# EAGLE design Senslope Alpha 5.0 (EAGLE 9.5.2)
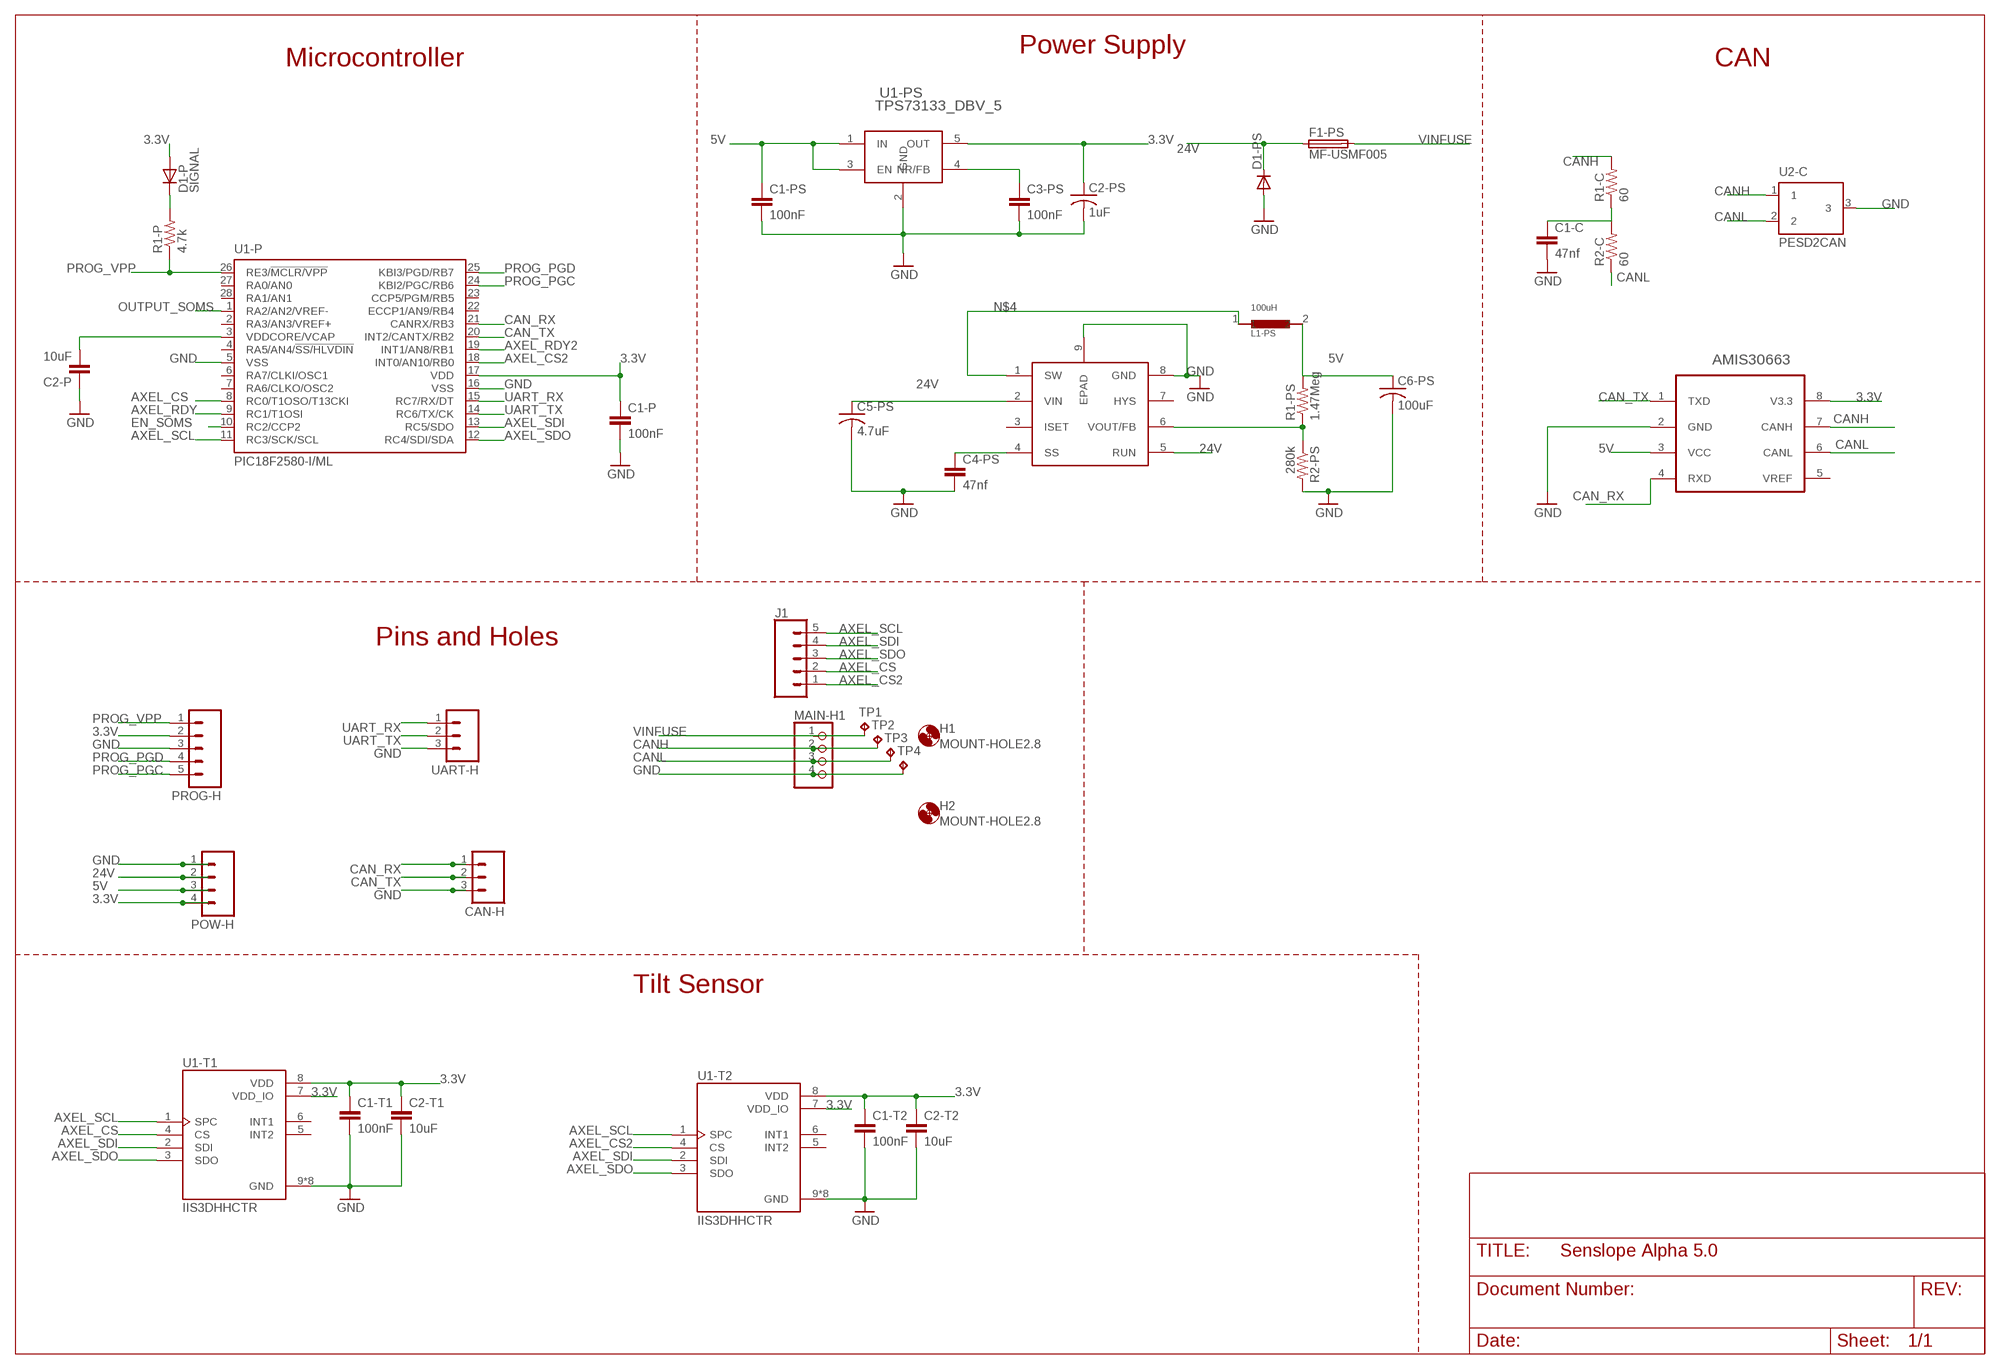
[diagram p0: schematic, sheet 1]

## Parts
C1-C  47nf  C-EUC0805  [C0805]
C1-P  100nF  C-EUC0603  [C0603]
C1-PS  100nF  C-EUC0603  [C0603]
C1-T1  100nF  C-EUC0603  [C0603]
C1-T2  100nF  C-EUC0603  [C0603]
C2-P  10uF  C-EUC0603  [C0603]
C2-PS  1uF  C-USC0402  [C0402]
C2-T1  10uF  C-EUC0603  [C0603]
C2-T2  10uF  C-EUC0603  [C0603]
C3-PS  100nF  C-EUC0603  [C0603]
C4-PS  47nf  C-EUC0805  [C0805]
C5-PS  4.7uF  C-USC1206K  [C1206K]
C6-PS  100uF  C-USC1210K  [C1210K]
CAN-H  UART  M031X03_NO_SILK  [1X03_NO_SILK]
D1-P  SIGNAL  DIODE0603  [DIODE-0603]
D1-PS  DIODE-DO-214AC  [DO-214AC]
F1-PS  MF-USMF005  MF-USMF075  [1210]
H1  MOUNT-HOLE2.8  [2,8]
H2  MOUNT-HOLE2.8  [2,8]
J1  CONN_05NO_SILK  [1X05_NO_SILK]
L1-PS  100uH  LQH32PN101MN0L  [1210]
MAIN-H1  PINHD-1X04_2.54  [1X04]
POW-H  M041X04_NO_SILK  [1X04_NO_SILK]
PROG-H  M05PTH  [1X05@1]
R1-C  60  R-US_R0805  [R0805]
R1-P  4.7k  R-US_R0603  [R0603]
R1-PS  1.47Meg  R-US_R0805  [R0805]
R2-C  60  R-US_R0805  [R0805]
R2-PS  280k  R-US_R0805  [R0805]
TP1  TPTP10SQ  [TP10SQ]
TP2  TPTP10SQ  [TP10SQ]
TP3  TPTP10SQ  [TP10SQ]
TP4  TPTP10SQ  [TP10SQ]
U1-P  PIC18F2580-I/ML  [QFN28-ML_6X6MM]
U1-PS  TPS73133_DBV_5  [DBV5]
U1-T1  IIS3DHHCTR  [IC_IIS3DHHCTR]
U1-T2  IIS3DHHCTR  [IC_IIS3DHHCTR]
U2  AMIS30663CAN  [SOIC8]
U2-C  PESD2CAN  [SOT23]
U2-PS  LTC3631-5  LTC3631  [MSOP8E]
UART-H  UART  M031X03_NO_SILK  [1X03_NO_SILK]

## Nets
3.3V: C1-P.1 C1-T1.1 C1-T2.1 C2-PS.1 C2-T1.1 C2-T2.1 D1-P.A POW-H.4 PROG-H.2 U1-P.17(VDD) U1-PS.5(OUT) U1-T1.7(VDD_IO) U1-T1.8(VDD) U1-T2.7(VDD_IO) U1-T2.8(VDD) U2.8(V3.3)
5V: C1-PS.1 C6-PS.1 L1-PS.2 POW-H.3 R1-PS.2 U1-PS.1(IN) U1-PS.3(EN) U2.3(VCC)
24V: C5-PS.1 D1-PS.1(C) F1-PS.1 POW-H.2 U2-PS.2(VIN) U2-PS.5(RUN)
AXEL_CS: J1.2 U1-P.8(RC0/T1OSO/T13CKI) U1-T1.4(CS)
AXEL_CS2: J1.1 U1-P.18(INT0/AN10/RB0) U1-T2.4(CS)
AXEL_RDY: U1-P.9(RC1/T1OSI)
AXEL_RDY2: U1-P.19(INT1/AN8/RB1)
AXEL_SCL: J1.5 U1-P.11(RC3/SCK/SCL) U1-T1.1(SPC) U1-T2.1(SPC)
AXEL_SDI: J1.4 U1-P.13(RC5/SDO) U1-T1.2(SDI) U1-T2.2(SDI)
AXEL_SDO: J1.3 U1-P.12(RC4/SDI/SDA) U1-T1.3(SDO) U1-T2.3(SDO)
CAN_RX: CAN-H.1 U1-P.21(CANRX/RB3) U2.4(RXD)
CAN_TX: CAN-H.2 U1-P.20(INT2/CANTX/RB2) U2.1(TXD)
CANH: MAIN-H1.2 R1-C.2 TP2.TP U2-C.1 U2.7(CANH)
CANL: MAIN-H1.3 R2-C.1 TP3.TP U2-C.2 U2.6(CANL)
EN_SOMS: U1-P.10(RC2/CCP2)
GND: C1-C.2 C1-P.2 C1-PS.2 C1-T1.2 C1-T2.2 C2-P.1 C2-PS.2 C2-T1.2 C2-T2.2 C3-PS.2 C4-PS.2 C5-PS.2 C6-PS.2 CAN-H.3 D1-PS.2(A) MAIN-H1.4 POW-H.1 PROG-H.3 R2-PS.2 TP4.TP U1-P.5(VSS) U1-P.16(VSS) U1-PS.2(GND) U1-T1.9(GND) U1-T1.10(GND) U1-T1.11(GND) U1-T1.12(GND) U1-T1.13(GND) U1-T1.14(GND) U1-T1.15(GND) U1-T1.16(GND) U1-T2.9(GND) U1-T2.10(GND) U1-T2.11(GND) U1-T2.12(GND) U1-T2.13(GND) U1-T2.14(GND) U1-T2.15(GND) U1-T2.16(GND) U2-C.3 U2-PS.8(GND) U2-PS.9(EPAD) U2.2(GND) UART-H.3
N$3: C1-C.1 R1-C.1 R2-C.2
N$4: L1-PS.1 U2-PS.1(SW)
N$5: C3-PS.1 U1-PS.4(NR/FB)
N$6: R1-PS.1 R2-PS.1 U2-PS.6(VOUT/FB)
N$7: D1-P.C R1-P.2
N$8: C4-PS.1 U2-PS.4(SS)
N$19: C2-P.2 U1-P.3(VDDCORE/VCAP)
OUTPUT_SOMS: U1-P.1(RA2/AN2/VREF-)
PROG_PGC: PROG-H.5 U1-P.24(KBI2/PGC/RB6)
PROG_PGD: PROG-H.4 U1-P.25(KBI3/PGD/RB7)
PROG_VPP: PROG-H.1 R1-P.1 U1-P.26(RE3/!MCLR/VPP)
UART_RX: U1-P.15(RC7/RX/DT) UART-H.1
UART_TX: U1-P.14(RC6/TX/CK) UART-H.2
VINFUSE: F1-PS.2 MAIN-H1.1 TP1.TP
Unconnected: U1-P.2(RA3/AN3/VREF+) U1-P.4(RA5/AN4/!SS/HLVDIN) U1-P.6(RA7/CLKI/OSC1) U1-P.7(RA6/CLKO/OSC2) U1-P.22(ECCP1/AN9/RB4) U1-P.23(CCP5/PGM/RB5) U1-P.27(RA0/AN0) U1-P.28(RA1/AN1) U1-T1.5(INT2) U1-T1.6(INT1) U1-T2.5(INT2) U1-T2.6(INT1) U2-PS.3(ISET) U2-PS.7(HYS) U2.5(VREF)

## Notes on the sheet
- Power Supply
- Microcontroller | CAN
- Pins and Holes
- Tilt Sensor

## Library data of the parts
C1-C C1-PS C1-T1 C1-T2 C2-P C2-T1 C2-T2 C3-PS C4-PS = rcl:C-EU: CAPACITOR, European symbol
C1-P = resistor:C-EU: CAPACITOR, European symbol
C2-PS C5-PS C6-PS = rcl:C-US: CAPACITOR, American symbol
CAN-H UART-H = SparkFun-Connectors:M03: Header 3 Standard 3-pin 0.1" header. Use with straight break away headers (SKU : PRT-00116), right angle break away headers (PRT-00553), swiss pins (PRT-00743), machine pins (PRT-00117), and female headers (PRT-00115). Molex polarized connector foot print use with SKU : PRT-08232 with associated crimp pins and housings.
D1-P = signal_diode:DIODE: Signal diode
D1-PS = dp_devices:DIODE: Various Diode Packages
F1-PS = DRMScustomlib:MF-USMF075
H1 H2 = holes:MOUNT-HOLE: MOUNTING HOLE with drill center marker
J1 = SparkFun-Connectors:CONN_05: Multi connection point. Often used as Generic Header-pin footprint for 0.1 inch spaced/style header connections On any of the 0.1 inch spaced packages, you can populate with these: Break Away Headers - Straight <https://www.sparkfun.com/products/116> (PRT-00116) Break Away Male Headers - Right Angle <https://www.sparkfun.com/products/553> (PRT-00553) Female Headers <https://www.sparkfun.com/products/115> (PRT-00115) Break Away Headers - Machine Pin <https://www.sparkfun.com/products/117> (PRT-00117) Break Away Female Headers - Swiss Machine Pin <https://www.sparkfun.com/products/743> (PRT-00743) For SCREWTERMINALS and SPRING TERMINALS visit here: Screw Terimnals on SparkFun.com <https://www.sparkfun.com/search/results?term=Screw+Terminals> (5mm/3.5mm/2.54mm spacing) This device is also useful as a general connection point to wire up your design to another part of your project. Our various solder wires solder well into these plated through hole pads. Hook-Up Wire - Assortment (Stranded, 22 AWG) <https://www.sparkfun.com/products/11375> (PRT-11375) Hook-Up Wire - Assortment (Solid Core, 22 AWG) <https://www.sparkfun.com/products/11367> (PRT-11367) View the entire wire category on our website here <https://www.sparkfun.com/categories/141> Special notes: Molex polarized connector foot print use with SKU : PRT-08231 with associated crimp pins and housings. 1MM SMD Version SKU: PRT-10208
L1-PS = 1210_inductor:LQH32PN101MN0L
MAIN-H1 = pinhead-2:PINHD-1X04: PIN HEADER
POW-H = SparkFun-Connectors:M04: Header 4 Standard 4-pin 0.1" header. Use with straight break away headers (SKU : PRT-00116), right angle break away headers (PRT-00553), swiss pins (PRT-00743), machine pins (PRT-00117), and female headers (PRT-00115). Molex polarized connector foot print use with SKU : PRT-08231 with associated crimp pins and housings. 1MM SMD Version SKU: PRT-10208
PROG-H = SparkFun-Connectors:M05: Header 5 Standard 5-pin 0.1" header. Use with straight break away headers (SKU : PRT-00116), right angle break away headers (PRT-00553), swiss pins (PRT-00743), machine pins (PRT-00117), and female headers (PRT-00115). Molex polarized connector foot print use with SKU : PRT-08230 with associated crimp pins and housings.
R1-C R1-PS R2-C R2-PS = rcl:R-US_: RESISTOR, American symbol
R1-P = resistor:R-US_: RESISTOR, American symbol
TP1-TP4 = testpad:TP: Test pad
U1-P = PIC18f25k80:PIC18F2*80: 28-Pin Enhanced Flash Microcontrollers with ECAN(TM) Technology 10-Bit A/D and nanoWatt Technology Source: http://www.microchip.com .. 39637a.pdf; MF: MICROCHIP; MPN: PIC18F2580-I/ML; OC_FARNELL: 1556180; OC_NEWARK: 71J7242
U1-PS = DRMScustomlib:TPS73133_DBV_5; DATASHEETURL: http://www.ti.com/lit/gpn/TPS73133; DESCRIPTION: Single Output LDO, 150mA, Fixed(3.3V), Cap free, Low Noise, Fast Transient Response; FAMILY_NAME: SINGLE CHANNEL LDO; GENERIC_PART_NUMBER: TPS73133; INDUSTRY_STD_PKG_TYPE: SOT-23; MANUFACTURER: Texas Instruments; MANUFACTURER_PART_NUMBER: tps73133_dbv_5; PACKAGE_DESIGNATOR: DBV; PIN_COUNT: 5; VENDOR: Texas Instruments
U1-T1 U1-T2 = IIS3DHHCTR:IIS3DHHCTR: High Resolution, High Stability 3-Axes Digital Accelerometer For Industrial Applications; AVAILABILITY: Unavailable; DESCRIPTION: High Resolution, High Stability 3-Axes Digital Accelerometer For Industrial Applications; MF: STMicroelectronics; MP: IIS3DHHCTR; PACKAGE: LGA-16 STMicroelectronics; PRICE: None
U2 = khr_lib4:AMIS30663CAN: https://www.onsemi.com/pub/Collateral/AMIS-30663-D.PDF; MPN: AMIS30663; OC_FARNELL: -; OC_NEWARK: 75C7726; PACKAGE: SOIC-8; SUPPLIER: On Semiconductor
U2-C = PESD2CAN:PESD2CAN
U2-PS = DRMScustomlib:LTC3631

## Board
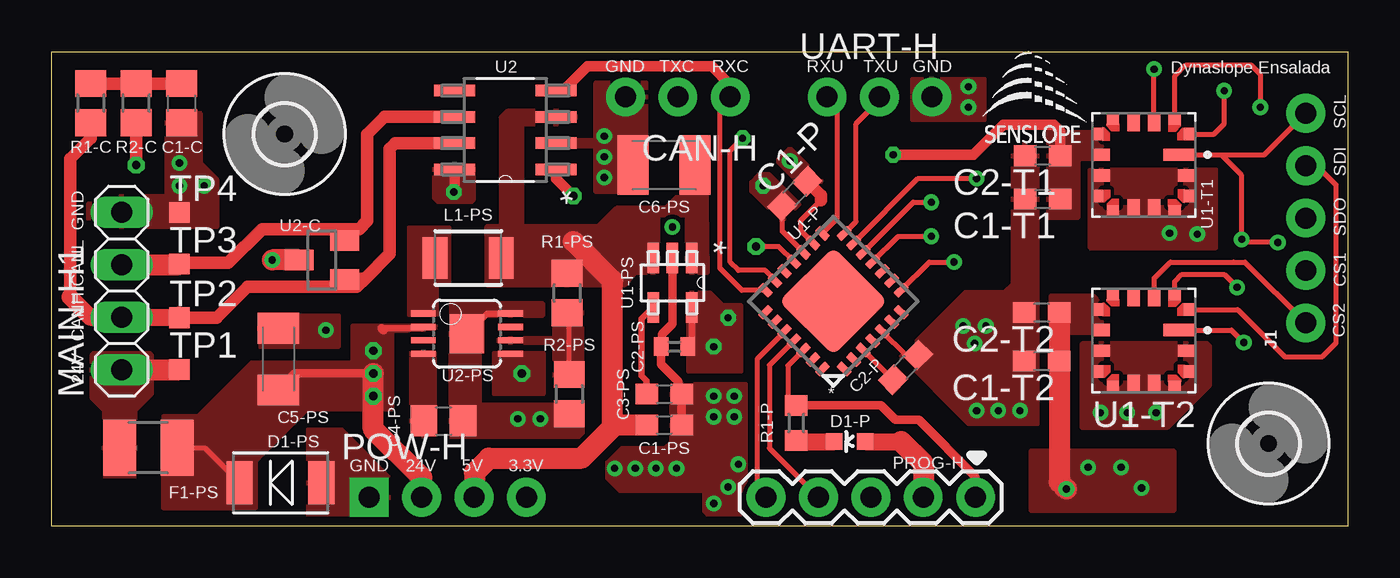
[diagram p1: board, top side]
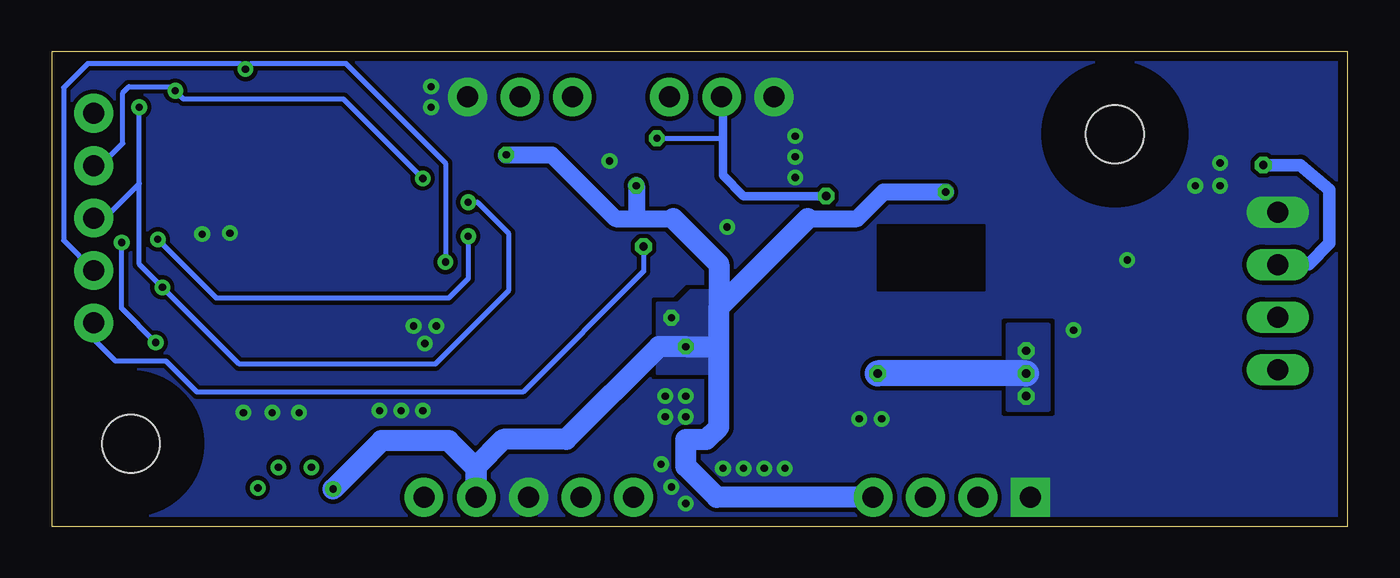
[diagram p2: board, bottom side, seen from below]

Size 62.85 x 23 mm. Coordinates in mm from the lower left corner, seen from the top.
Outline: 62.85,23 62.85,0 0,0 0,23 62.85,23
Copper layers (1*16): Top 0.035mm / dielectric 0.5mm / Route 0.035mm
Design rules "default *": minimum track width 6mil, minimum drill 6mil, track to track 8mil, track to pad 8mil, pad to pad 8mil, via to via 8mil, smd to smd 0mil, copper to edge 18mil, drill to drill 8mil, minimum pad ring 10mil, minimum via ring 8mil, stop-mask expansion 4mil, vias tented up to drill 0mil, thermal gap 0mil
bRestrict: area 17.6,11.4 to 22.8,14.6

### Footprints (pad centres in the part's own frame; a part is rotated, then mirrored left to right if it is on the bottom)
C0805 = smd 1.3 x 1.5: 1 -0.95,0; 2 0.95,0
C0603 = smd 1.1 x 1: 1 -0.85,0; 2 0.85,0
C0402 = smd 0.7 x 0.9: 1 -0.65,0; 2 0.65,0
C1206K = smd 1.5 x 2: 1 -1.5,0; 2 1.5,0
C1210K = smd 1.5 x 2.9: 1 -1.5,0; 2 1.5,0
1X03_NO_SILK = drill 1.016 pad 1.88: 1 0,0; 2 2.54,0; 3 5.08,0
DIODE-0603 = smd 0.8 x 0.8: A 0,-0.75; C 0,0.75
DO-214AC = smd 1.27 x 2.1: 1 -1.98,0; 2 1.98,0
1210 = smd 1.6 x 2.7: 1 -1.4,0; 2 1.4,0
2,8 = hole 2.8: 0,0
1X05_NO_SILK = drill 1.016 pad 1.88: 1 0,0; 2 2.54,0; 3 5.08,0; 4 7.62,0; 5 10.16,0
1210' = smd 1.2 x 2: 1 -1.6,0; 2 1.6,0
1X04 = drill 1.016 long: 1 -3.81,0; 2 -1.27,0; 3 1.27,0; 4 3.81,0
1X04_NO_SILK = drill 1.016 pad 1.88 square: 1 0,0 | drill 1.016 pad 1.88: 2 2.54,0; 3 5.08,0; 4 7.62,0
1X05@1 = drill 1.016 pad 1.88: 1 0,0; 2 2.54,0; 3 5.08,0; 4 7.62,0; 5 10.16,0
R0805 = smd 1.3 x 1.5: 1 -0.95,0; 2 0.95,0
R0603 = smd 1 x 1.1: 1 -0.85,0; 2 0.85,0
TP10SQ = smd 1 x 1: TP 0,0
QFN28-ML_6X6MM = smd 0.7 x 0.35: 1 -2.7,1.95; 2 -2.7,1.3; 3 -2.7,0.65; 4 -2.7,0; 5 -2.7,-0.65; 6 -2.7,-1.3; 7 -2.7,-1.95; 15 2.7,-1.95; 16 2.7,-1.3; 17 2.7,-0.65; 18 2.7,0; 19 2.7,0.65; 20 2.7,1.3; 21 2.7,1.95 | smd 0.35 x 0.7: 8 -1.95,-2.7; 9 -1.3,-2.7; 10 -0.65,-2.7; 11 0,-2.7; 12 0.65,-2.7; 13 1.3,-2.7; 14 1.95,-2.7; 22 1.95,2.7; 23 1.3,2.7; 24 0.65,2.7; 25 0,2.7; 26 -0.65,2.7; 27 -1.3,2.7; 28 -1.95,2.7 | smd 3.7 x 3.7: EXP 0,0
DBV5 = smd 1.473 x 0.559: 1 -1.194,0.94; 2 -1.194,0; 3 -1.194,-0.94; 4 1.194,-0.94; 5 1.194,0.94
IC_IIS3DHHCTR = smd 1.5 x 0.6: 1 -1.7,-0.5 | smd 0.5 x 0.6: 2 -2.2,-1.5; 7 2.2,-1.5; 10 2.2,1.5; 15 -2.2,1.5 | smd 0.6 x 0.5: 3 -1.5,-2.2; 6 1.5,-2.2; 11 1.5,2.2; 14 -1.5,2.2 | smd 0.6 x 0.8: 4 -0.5,-2.05; 5 0.5,-2.05; 12 0.5,2.05; 13 -0.5,2.05 | smd 0.8 x 0.6: 8 2.05,-0.5; 9 2.05,0.5; 16 -2.05,0.5
SOIC8 = smd 1.981 x 0.559: 1 -0.464,4.405; 2 -0.464,3.135; 3 -0.464,1.865; 4 -0.464,0.595; 5 4.464,0.595; 6 4.464,1.865; 7 4.464,3.135; 8 4.464,4.405
SOT23 = smd 1 x 1.4: 1 -0.95,-1.1; 2 0.95,-1.1; 3 0,1.1
MSOP8E = smd 0.3 x 1.2: 1 0.294,0.427; 2 0.944,0.427; 3 1.594,0.427; 4 2.244,0.427; 5 2.244,4.652; 6 1.594,4.652; 7 0.944,4.652; 8 0.294,4.652 | smd 1.88 x 1.676: 9 1.27,2.54

### Placement (x,y rotation side)
C1-C  6.3,20.5 270 top
C1-P  36.03,16.11 45 top
C1-PS  29.7,4.9 0 top
C1-T1  48.05,15.85 180 top
C1-T2  48,8 180 top
C2-P  41.4,7.7 225 top
C2-PS  30.2,8.7 180 top
C2-T1  48.05,17.95 180 top
C2-T2  48,10.35 180 top
C3-PS  29.7,6.4 0 top
C4-PS  19,5.1 0 top
C5-PS  11,8.1 90 top
C6-PS  29.7,17.5 180 top
CAN-H  32.9,20.8 180 top
D1-P  38.7,4.1 90 top
D1-PS  11.1,2.1 0 top
F1-PS  4.7,3.8 180 top
H1  59,4 0 top
H2  11.3,19 0 top
J1  60.8,9.85 90 top
L1-PS  100uH  [1210']  20.2,13 0 top
MAIN-H1  3.4,11.4 90 top
POW-H  15.4,1.4 0 top
PROG-H  44.8,1.4 180 top
R1-C  1.9,20.5 270 top
R1-P  36.1,5 270 top
R1-PS  25,11.3 90 top
R2-C  4.1,20.5 90 top
R2-PS  25.1,6.4 270 top
TP1  6.2,7.6 0 top
TP2  6.2,10.1 0 top
TP3  6.2,12.7 0 top
TP4  6.2,15.2 0 top
U1-P  37.9,10.9 135 top
U1-PS  30.1,11.8 270 top
U1-T1  52.95,17.5 180 top
U1-T2  52.95,9 180 top
U2  24,21.7 180 top
U2-C  13.1,12.9 90 top
U2-PS  17.6,10.6 270 top
U$1  [LOGO_SML_TNAME]  47.45,20.2 0 top
UART-H  37.6,20.8 0 top

### Tracks (layer width: path | path; a pad name or v marks a point on that pad's centre or on a via)
3.3V  (via drill 0.35)
  Top 0.254: U1-P.17 35.43,14.29 C1-P.1
  Top 0.305: U1-PS.5 31.04,8.89 C2-PS.1
  Top 0.508: U2.8 19.54,16.24 v19.5,16.2 | v40.8,18 44.7,18 46.15,19.45 48.6,19.45 48.9,19.15 C2-T1.1
  Top 0.813: D1-P.A 41.2,4.1
  Top 1.016: PROG-H.2 42.26,3.04 41.2,4.1 | v49.2,1.8 48.85,2.15 C1-T2.1 C2-T2.1
  Route 0.813: v40.8,18 38.6,18 35.5,14.9 34.5,14.9 | 34.5,14.9 32.7,14.9 | 26.2,14.9 23.8,14.9 22.5,16.2 v19.5,16.2 | v34.5,16.5 34.5,14.9
  Route 1.016: POW-H.4 30.6,1.4 32.1,2.9 32.1,4.2 31.1,4.2 30.5,4.8 30.5,8.7 | 30.5,8.7 30.5,10.6 | 30.5,10.6 26.2,14.9 | 32.7,14.9 30.5,12.7 30.5,10.6 | 30.5,8.7 v32.1,8.7 33.4,8.7 37.9,4.2 40.95,4.2 42.26,2.89 PROG-H.2 42.26,2.81 43.6,4.15 46.85,4.15 v49.2,1.8
  other vias: 32.8,10.1 50.25,2.85 51.85,2.85 52.85,1.85
  pour Top: 30.9,11.3 31.9,11.3 32.5,10.7 33.4,10.7 33.4,7.5 30.9,7.5
  pour Top: 35.4,14.7 33.9,16.2 33.9,16.7 34.3,17.1 34.8,17.1 36.3,15.6
  pour Top: 18.5,17.6 18.5,15.9 18.7,15.7 20.4,15.7 20.5,15.8 20.5,17.6
  pour Route: 31.3,11.4 31.9,11.4 32.5,10.8 33.5,10.8 33.5,7.4 30.9,7.4 30.9,11.4
  pour Top: 49.75,14.95 48.35,14.95 48.35,19.1 51.05,19.1 51.05,17.8 49.85,17.8 49.75,17.7 49.75,15
  pour Top: 54.4,3.65 54.4,0.75 47.5,0.75 47.5,3.65
  pour Top: 48.45,11.15 48.45,9.45 48.5,9.4 50.95,9.4 50.95,10.7 50.55,11.1 50.5,11.15
5V
  Top 1.016: 25.3,13.8 27.2,11.9 27.2,4.9 | 27.2,4.9 27.2,4.8 25.7,3.3 21.2,3.3 20.5,2.6 20.5,1.42 POW-H.3 | C1-PS.1 27.2,4.9
  pour Top: 21.1,14.5 21.1,11.7 27.8,11.7 28.3,12.3 29.4,12.3 29.4,15.1 30.8,15.1 30.8,12.3 31.8,12.3 31.7,18.8 30.6,18.8 30.6,16.2 29.8,15.4 27.4,15.4 26.5,14.5 22.8,14.5 22.8,19.5 25.4,19.5 25.4,20.1 22.1,20.1 21.8,19.8 21.8,14.5
24V  (via drill 0.4)
  Top 0.254: F1-PS.1 7.42,3.8 D1-PS.1
  Top 0.305: 16,9.6 17.97,9.6 U2-PS.2
  Top 0.406: 16.1,9.5 16,9.6 | v15.6,7.4 11.8,7.4 C5-PS.1
  Top 1.016: POW-H.2 17.94,2.36 15.6,4.7 v15.6,7.4
  Route 1.27: v15.6,7.4 v22.8,7.4
  other vias: 15.6,6.3 15.6,8.5
  pour Top (isolate 0.254): 5.4,5.3 5.4,0.9 9.9,0.9 9.9,3.2 12.4,5.7 16.5,5.7 16.5,9.5 18.6,9.5 18.6,9.7 14.6,9.7 14.6,7.9 9.7,7.9 7.1,5.3
  pour Top: 21.4,8.4 21.4,6.4 23.9,6.4 23.9,8.4
  pour Route: 16.5,5.6 16.5,9.8 14.5,9.8 14.5,5.6
AXEL_CS  (via drill 0.35)
  Top 0.254: U1-T1.4 v53.45,22.15 | U1-P.8 42.56,12.8 v43.75,12.8
  Route 0.254: J1.2 62.27,13.86 62.27,21.25 61.1,22.42 53.72,22.42 v53.45,22.15 53.18,22.42 48.57,22.42 43.75,17.6 v43.75,12.8
AXEL_CS2  (via drill 0.4)
  Top 0.254: U1-P.18 35.25,13.55 v34.15,13.55 | U1-T2.4 53.45,12 54.25,12.8 57.3,12.8 57.31,12.79 57.86,12.79 J1.1
  Route 0.254: v34.15,13.55 34.15,12.35 40,6.5 55.8,6.5 57.3,8 59.75,8 60.8,9.05 J1.1
AXEL_SCL  (via drill 0.35)
  Top 0.254: U1-P.11 41.05,14.05 v42.65,14.05 | J1.5 58.79,18 56.7,18 | 56.7,18 57.7,17 v57.7,13.9 57.85,13.75 v59.45,13.75 | U1-T2.1 57.2,9.5 v57.8,8.9 | U1-T1.1 56.7,18
  Route 0.254: v42.65,14.05 42.65,12 43.6,11.05 54.85,11.05 v57.7,13.9 | v57.8,8.9 59.45,10.55 v59.45,13.75
AXEL_SDI  (via drill 0.35)
  Top 0.254: U1-P.13 42.01,16.85 v44.85,16.85 | U1-T1.2 56.35,19 56.85,19.5 v56.85,21.1 | J1.4 61.35,17.47 62.27,16.55 62.27,8.87 61.6,8.2 59.8,8.2 57.5,10.5 U1-T2.2
  Route 0.254: J1.4 60.48,17.47 59.4,18.55 59.4,21 59.1,21.3 57.05,21.3 v56.85,21.1 56.45,20.7 48.7,20.7 v44.85,16.85
AXEL_SDO  (via drill 0.35)
  Top 0.254: U1-P.12 41.78,15.7 v42.65,15.7 | U1-T1.3 54.45,21.8 55,22.35 58.15,22.35 58.6,21.9 v58.6,20.3 | U1-T2.3 54.45,11.85 54.8,12.2 56.85,12.2 v57.48,11.57
  Route 0.254: v42.65,15.7 42.2,15.7 40.7,14.2 40.7,11.4 44.25,7.85 53.75,7.85 v57.48,11.57 58.6,12.7 58.6,16.6 | 58.6,16.6 v58.6,20.3 | 58.6,16.6 60.27,14.93 J1.3
CAN_RX
  Top 0.254: U1-P.21 33.47,11.43 32.4,12.5 32.4,20.3 CAN-H.1
  Top 0.508: U2.4 24.8,21.11 25.99,22.29 32.01,22.29 32.9,21.4 CAN-H.1
CAN_TX  (via drill 0.35, 0.4)
  Top 0.254: U1-P.20 35.07,11.93 34.6,12.4 33.3,12.4 32.9,12.8 32.9,18.2 v33.5,18.8
  Top 0.508: U2.1 24.46,16.84 v25.3,16
  Route 0.254: v33.5,18.8 30.4,18.8 30.3,18.7
  Route 0.406: v25.3,16 29.3,16 30.3,17 30.3,18.7 30.3,20.54 CAN-H.2
CANH
  Top 0.61: R1-C.2 1.9,18.8 0.9,17.8 0.9,11.1 | U2.7 16.66,18.57 16.4,18.3 16.4,13.2 15.2,12 | 15.2,12 14.25,12 U2-C.1 | TP2.TP 8,10.1 9.5,11.6 14.8,11.6 15.2,12
  Top 0.813: 0.9,11.1 1.87,10.13 MAIN-H1.2 6.17,10.13
  Top 1.016: 6.17,10.13 TP2.TP
CANL  (via drill 0.4)
  Top 0.61: R2-C.1 v4.1,17.5 | TP3.TP 6.27,12.77 8.57,12.77 10.2,14.4 14.5,14.4 | 14.5,14.4 14.9,14.4 15.3,14.8 15.3,19 16.14,19.84 U2.6 | U2-C.2 14.2,14.1 14.5,14.4
  Top 1.016: MAIN-H1.3 6.17,12.67 TP3.TP
  Route 0.61: v4.1,17.5 2.3,17.5 0.9,16.3 0.9,13.7 1.9,12.7 3.37,12.7 MAIN-H1.3
GND  (via drill 0.35)
  Top 0.254: U1-P.16 36.3,14.34 36.3,14.8 37.3,15.8 | C2-P.1 41.42,8.3 U1-P.5
  Top 0.305: U2-PS.8 21.12,10.31 U2-PS.9
  Top 0.406: U1-PS.2 30.1,9.8 29.6,9.3 29.6,8.75 C2-PS.2 29.55,7.85 30.4,7 30.4,6.35 C3-PS.2 C1-PS.2
  Top 0.61: C1-P.2 37.3,16.04 37.3,15.8
  Top 1.016: U2-C.3 v10.7,12.9
  other vias: 13.3,9.5 7.4,16.5 6.2,16.5 26.8,18.9 26.8,17.9 30.1,14.5 23.7,5.2 22.6,5.2 35.8,17.7 32.1,6.3 44.45,20.3 44.45,21.3 33.1,6.3 33.1,5.3 32.1,5.3 26.8,16.9 30.3,2.8 29.3,2.8 28.3,2.8 27.3,2.8 32.1,1.1 33.3,3 6.2,17.6 32.8,1.9 54.2,14.2 55.55,14.15 44.2,9.7 45.3,9.7 44.85,5.6 50.85,5.5 52.15,5.5 53.55,5.5 45.9,5.6 46.95,5.6 44.75,8.85
  pour Top (isolate 0.254): 41.7,19.65 41.7,21.7 45.25,21.7 45.25,19.65
  pour Top (isolate 0.254): 1.8,14.9 1.8,15.6 2.2,16 5.6,16 5.6,20 5.7,20.1 7.1,20.1 7.2,20 7.2,17.6 8,16.8 8,14.5 2.2,14.5
  pour Top (isolate 0.254): 37.3,16.7 37.3,16.8 35.8,18.3 35.2,17.7 36.7,16.2 36.8,16.2
  pour Top (isolate 0.254): 10.1,10.2 13.9,10.2 13.9,8.7 10.1,8.7
  pour Top (isolate 0.254): 12.4,4.7 12.4,0.3 16.3,0.3 16.4,0.4 16.4,2.4 14.1,4.7
  pour Top: 19.3,10.1 19.3,4.3 25.8,4.3 25.8,5.9 20.8,5.9 20.8,10.1
  pour Top: 19.4,8.4 19.4,10.8 23.8,10.8 23.8,10.2 20.8,10.2 20.8,8.4
  pour Top: 26.4,21.5 28.8,21.5 28.8,16.2 26.4,16.2 26.4,18.4 23.6,18.4 23.6,18.7 26.4,18.7
  pour Top: 30,6.9 30,4.1 29.7,3.8 27.6,3.8 26.9,3.1 26.9,2.3 27.5,1.7 31.6,1.7 31.6,0.7 31.8,0.5 33.4,0.5 33.4,1.6 33.7,2.2 33.7,6.9
  pour Route (rank 6): 0,23 62.9,23 62.9,0 0,0
  pour Top: 50.35,17.25 50.35,13.5 56.45,13.5 56.45,17.25
  pour Top: 47.8,18.45 47.8,4.95 44.45,4.95 41.17,8.22 44.3,11.35 46.2,11.35 46.6,11.75 46.6,18.5 47.75,18.5
  pour Top: 49.95,8.8 49.95,4.8 54.1,4.8 56.15,6.85 56.15,8.7 56,8.85 50,8.85
N$3
  Top 0.61: R1-C.1 R2-C.2 C1-C.1
N$4
  pour Top (isolate 0.254): 18.7,10.2 17.3,10.2 17.3,14.5 19.3,14.5 19.3,11.7 18.7,11.7
N$5
  Top 0.305: C3-PS.1 28.85,7.05 28.6,7.3 28.6,10.05 U1-PS.4
N$6
  Top 0.254: R2-PS.1 25.1,10.25 R1-PS.1
  pour Top: 24.4,6.8 24.4,10.9 25.7,10.9 25.7,6.8
  pour Top: 21.7,9.1 24.5,9.1 24.5,8.9 21.7,8.9
N$7
  Top 0.813: R1-P.2 36.15,4.1 D1-P.C
N$8
  pour Top: 17.4,8.5 18.6,8.5 18.6,4.3 17.4,4.3
N$19
  Top 0.254: U1-P.3 39.37,8.53 C2-P.2
PROG_PGC
  Top 0.254: U1-P.24 35.53,9.43 34.2,8.1 34.2,4.2 34.2,1.84 PROG-H.5
PROG_PGD
  Top 0.254: U1-P.25 34.8,7.8 34.8,3.78 PROG-H.4
PROG_VPP
  Top 0.254: U1-P.26 35.7,7.78 35.7,6.25 R1-P.1
  Top 0.406: PROG-H.1 44.8,2.4 42.05,5.15 40.9,5.15 40.2,5.85 R1-P.1
UART_RX
  Top 0.254: U1-P.15 38.1,14.92 38.1,20.6 37.9,20.8 UART-H.1
UART_TX
  Top 0.254: U1-P.14 39,14.76 39,19.5 40.14,20.64 UART-H.2
VINFUSE
  Top 1.016: MAIN-H1.1 TP1.TP
  pour Top: 2.5,2.4 4.1,2.4 4.1,5.6 4.8,6.3 4.9,6.4 4.9,8.3 4.8,8.4 2,8.4 1.9,8.3 1.9,6.2 2.5,5.6

### Text on the board
tNames: Dynaslope Ensalada | GND | TXC | RXC | RXU | TXU | GND | SCL | SDI | GND | SDO | CANL | CS1 | CANH | CS2 | 24V | * | GND | 24V | 5V | 3.3V